# EAGLE schematic sensor-astable-multivibrator-v2 (EAGLE 6.2)
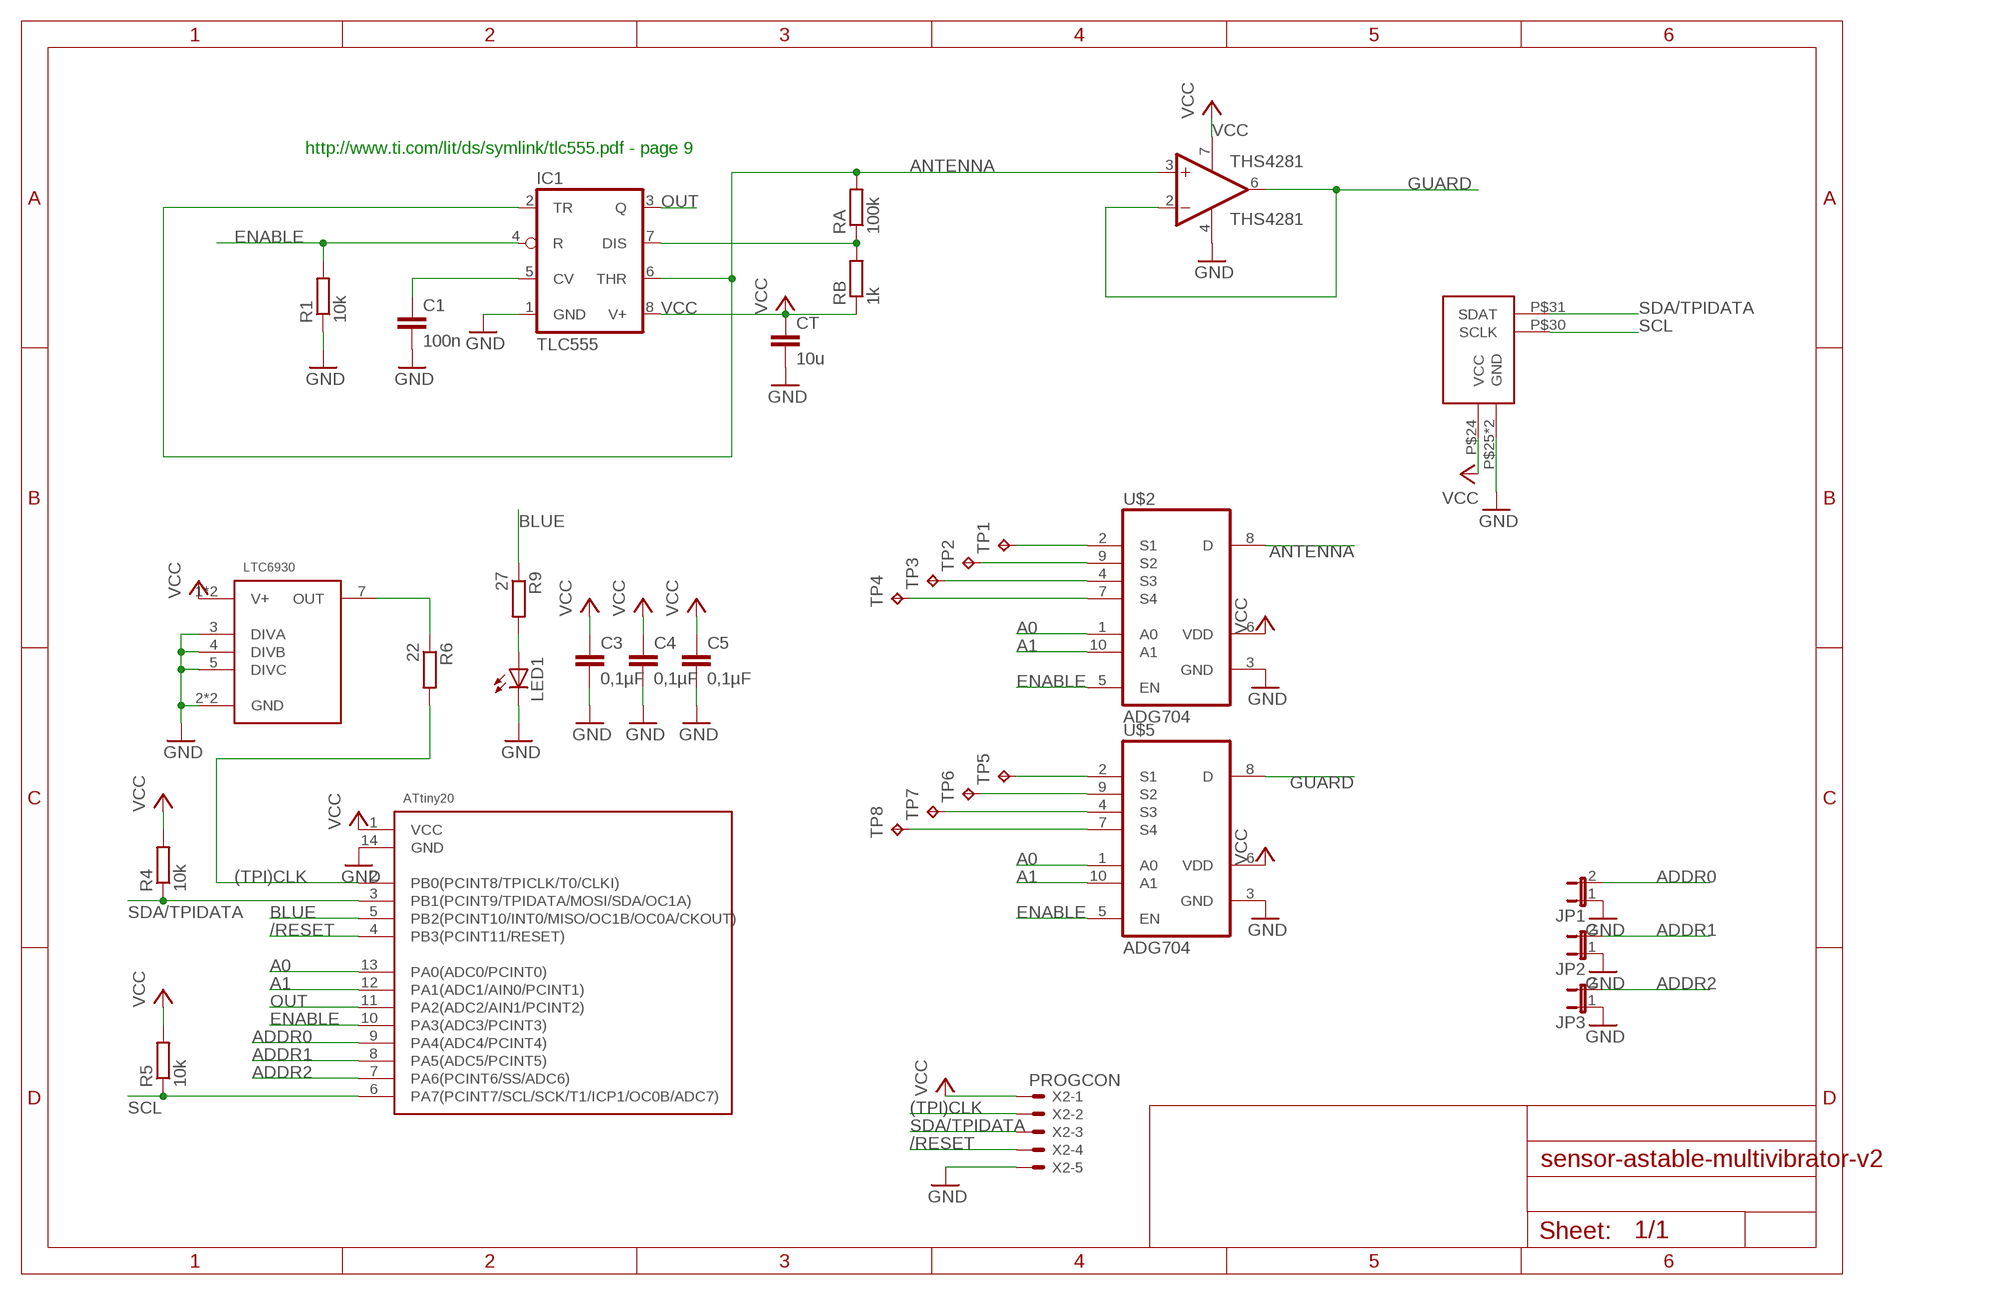
[diagram p0: schematic, sheet 1]

## Parts
C1  100n  C-EUC0805  [C0805]
C3  0,1µF  C-EUC0805  [C0805]
C4  0,1µF  C-EUC0805  [C0805]
C5  0,1µF  C-EUC0805  [C0805]
CT  10u  C-EUC0805  [C0805]
IC1  TLC555  LM555D  [SO08]
JP1  JUMPER-2SMD-NO  [SJ_2S-NO]
JP2  JUMPER-2SMD-NO  [SJ_2S-NO]
JP3  JUMPER-2SMD-NO  [SJ_2S-NO]
LED1  LEDCHIPLED_0805  [CHIPLED_0805]
R1  10k  R-EU_R0805  [R0805]
R4  10k  R-EU_R0805  [R0805]
R5  10k  R-EU_R0805  [R0805]
R6  22  R-EU_R0805  [R0805]
R9  27  R-EU_R0805  [R0805]
RA  100k  R-EU_R0805  [R0805]
RB  1k  R-EU_R0805  [R0805]
THS4281  THS4281  OPA345U  [SO08]
TP1  TPTP20SQ  [TP20SQ]
TP2  TPTP20SQ  [TP20SQ]
TP3  TPTP20SQ  [TP20SQ]
TP4  TPTP20SQ  [TP20SQ]
TP5  TPTP20SQ  [TP20SQ]
TP6  TPTP20SQ  [TP20SQ]
TP7  TPTP20SQ  [TP20SQ]
TP8  TPTP20SQ  [TP20SQ]
U$1  CAPSENSE-BREAKOUT-I2C  [JENNIC-FOOTPRINT-RB]
U$2  ADG704  [MSOP10]
U$3  LTC6930-X.XX  [MSOP8]
U$4  ATTINY20  [TSSOP14]
U$5  ADG704  [MSOP10]
X2  PROGCON  [53047-05-OCT]

## Nets
(TPI)CLK: R6.2 U$4.2(PB0(PCINT8/TPICLK/T0/CLKI)) X2.2
/RESET: U$4.4(PB3(PCINT11/RESET)) X2.4
A0: U$2.1(A0) U$4.13(PA0(ADC0/PCINT0)) U$5.1(A0)
A1: U$2.10(A1) U$4.12(PA1(ADC1/AIN0/PCINT1)) U$5.10(A1)
ADDR0: JP1.2 U$4.9(PA4(ADC4/PCINT4))
ADDR1: JP2.2 U$4.8(PA5(ADC5/PCINT5))
ADDR2: JP3.2 U$4.7(PA6(PCINT6/SS/ADC6))
ANTENNA: IC1.2(TR) IC1.6(THR) RA.2 THS4281.3(+IN) U$2.8(D)
BLUE: R9.1 U$4.5(PB2(PCINT10/INT0/MISO/OC1B/OC0A/CKOUT))
ENABLE: IC1.4(R) R1.2 U$2.5(EN) U$4.10(PA3(ADC3/PCINT3)) U$5.5(EN)
GND: C1.2 C3.2 C4.2 C5.2 CT.2 IC1.1(GND) JP1.1 JP2.1 JP3.1 LED1.C R1.1 THS4281.4(V-) U$1.P$25(GND) U$1.P$26(GND) U$2.3(GND) U$3.2(GND) U$3.3(DIVA) U$3.4(DIVB) U$3.5(DIVC) U$3.6(GND) U$4.14(GND) U$5.3(GND) X2.5
GUARD: THS4281.2(-IN) THS4281.6(OUT) U$5.8(D)
N$1: IC1.7(DIS) RA.1 RB.2
N$2: TP1.TP U$2.2(S1)
N$3: C1.1 IC1.5(CV)
N$4: TP2.TP U$2.9(S2)
N$5: TP3.TP U$2.4(S3)
N$6: TP4.TP U$2.7(S4)
N$7: TP5.TP U$5.2(S1)
N$8: TP6.TP U$5.9(S2)
N$9: TP7.TP U$5.4(S3)
N$10: TP8.TP U$5.7(S4)
N$11: R6.1 U$3.7(OUT)
N$12: LED1.A R9.2
OUT: IC1.3(Q) U$4.11(PA2(ADC2/AIN1/PCINT2))
SCL: R5.1 U$1.P$30(SCLK) U$4.6(PA7(PCINT7/SCL/SCK/T1/ICP1/OC0B/ADC7))
SDA/TPIDATA: R4.1 U$1.P$31(SDAT) U$4.3(PB1(PCINT9/TPIDATA/MOSI/SDA/OC1A)) X2.3
VCC: C3.1 C4.1 C5.1 CT.1 IC1.8(V+) R4.2 R5.2 RB.1 THS4281.7(V+) U$1.P$24(VCC) U$2.6(VDD) U$3.1(V+) U$3.8(V+) U$4.1(VCC) U$5.6(VDD) X2.1

## Notes on the sheet
- http://www.ti.com/lit/ds/symlink/tlc555.pdf - page 9

## Library data of the parts
C1 C3-C5 CT = rcl:C-EU: CAPACITOR, European symbol
IC1 = linear:*555: TIMER
JP1-JP3 = SparkFun:JUMPER-2: Jumper Basic 0.1" spaced jumper. Use with breakaway headers.
LED1 = led:LED: LED OSRAM: - CHIPLED LG R971, LG N971, LY N971, LG Q971, LY Q971, LO R971, LY R971 LH N974, LH R974 LS Q976, LO Q976, LY Q976 LO Q996 - Hyper CHIPLED LW Q18S LB Q993, LB Q99A, LB R99A - SideLED LS A670, LO A670, LY A670, LG A670, LP A670 LB A673, LV A673, LT A673, LW A673 LH A674 LY A675 LS A676, LA A676, LO A676, LY A676, LW A676 LS A679, LY A679, LG A679 - Hyper Micro SIDELED® LS Y876, LA Y876, LO Y876, LY Y876 LT Y87S - SmartLED LW L88C, LW L88S LB L89C, LB L89S, LG L890 LS L89K, LO L89K, LY L89K LS L896, LA L896, LO L896, LY L896 - TOPLED LS T670, LO T670, LY T670, LG T670, LP T670 LSG T670, LSP T670, LSY T670, LOP T670, LYG T670 LG T671, LOG T671, LSG T671 LB T673, LV T673, LT T673, LW T673 LH T674 LS T676, LA T676, LO T676, LY T676, LB T676, LH T676, LSB T676, LW T676 LB T67C, LV T67C, LT T67C, LS T67K, LO T67K, LY T67K, LW E67C LS E67B, LA E67B, LO E67B, LY E67B, LB E67C, LV E67C, LT E67C LW T67C LS T679, LY T679, LG T679 LS T770, LO T770, LY T770, LG T770, LP T770 LB T773, LV T773, LT T773, LW T773 LH T774 LS E675, LA E675, LY E675, LS T675 LS T776, LA T776, LO T776, LY T776, LB T776 LHGB T686 LT T68C, LB T68C - Hyper Mini TOPLED® LB M676 - Mini TOPLED Santana® LG M470 LS M47K, LO M47K, LY M47K Source: http://www.osram.convergy.de LUXEON: - LUMILED® LXK2-PW12-R00, LXK2-PW12-S00, LXK2-PW14-U00, LXK2-PW14-V00 LXK2-PM12-R00, LXK2-PM12-S00, LXK2-PM14-U00 LXK2-PE12-Q00, LXK2-PE12-R00, LXK2-PE12-S00, LXK2-PE14-T00, LXK2-PE14-U00 LXK2-PB12-K00, LXK2-PB12-L00, LXK2-PB12-M00, LXK2-PB14-N00, LXK2-PB14-P00, LXK2-PB14-Q00 LXK2-PR12-L00, LXK2-PR12-M00, LXK2-PR14-Q00, LXK2-PR14-R00 LXK2-PD12-Q00, LXK2-PD12-R00, LXK2-PD12-S00 LXK2-PH12-R00, LXK2-PH12-S00 LXK2-PL12-P00, LXK2-PL12-Q00, LXK2-PL12-R00 Source: www.luxeon.com KINGBRIGHT: KA-3528ASYC Source: www.kingbright.com
R1 R4-R6 R9 RA RB = rcl:R-EU_: RESISTOR, European symbol
THS4281 = linear:OPA*: Single Operational Amplifier Low Power, Single-Supply, Rail-To-Rail Operational Amplifier Source: http://focus.ti.com/lit/ds/symlink/opa2345.pdf
TP1-TP8 = testpad:TP: Test pad
U$1 = zittel:CAPSENSE-BREAKOUT-I2C
U$2 U$5 = zittel:ADG704
U$3 = zittel:LTC6930-X.XX
U$4 = zittel:ATTINY20
X2 = HedgehogLib:PROGCON: Programmer Connector wire to board 1.25 mm (.049 inch) pitch header